# EAGLE schematic HWProgUSB (EAGLE 6.3)
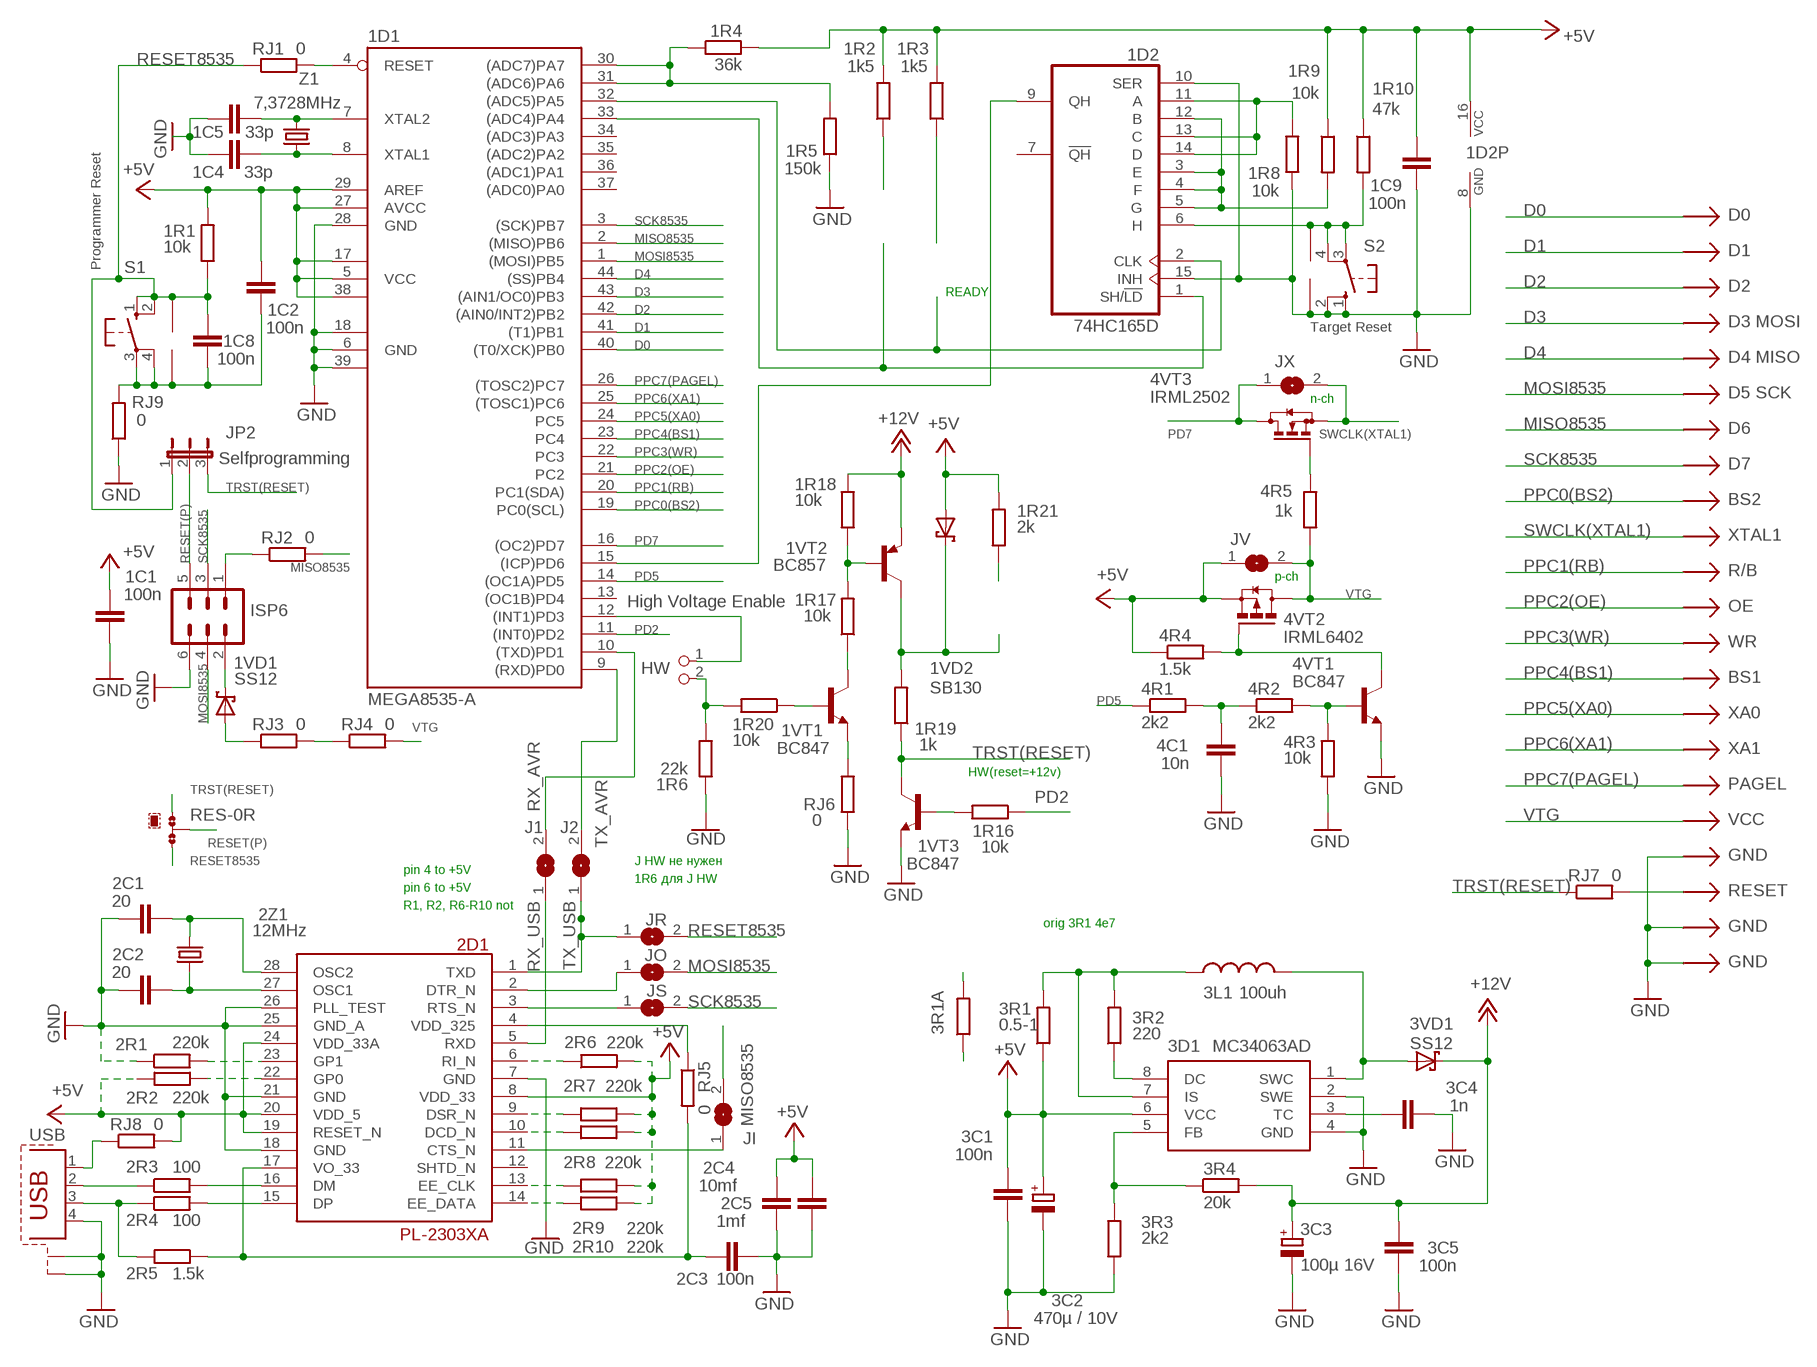
[diagram p0: schematic, sheet 1]

## Parts
1C1  100n  C-EUC0805  [C0805]
1C2  100n  C-EUC0805  [C0805]
1C4  33p  C-EUC0805  [C0805]
1C5  33p  C-EUC0805  [C0805]
1C8  100n  C-EUC0805  [C0805]
1C9  100n  C-EUC0805  [C0805]
1D1  MEGA8535-A  [TQFP44]
1D2  74HC165D  [SO16]
1R1  10k  R-EU_M0805  [M0805]
1R2  1k5  R-EU_M0805  [M0805]
1R3  1k5  R-EU_M0805  [M0805]
1R4  36k  R-EU_M0805  [M0805]
1R5  150k  R-EU_R1206  [R1206]
1R6  22k  R-EU_M1206  [M1206]
1R8  10k  R-EU_M0805  [M0805]
1R9  10k  R-EU_M0805  [M0805]
1R10  47k  R-EU_M0805  [M0805]
1R16  10k  R-EU_R0805  [R0805]
1R17  10k  R-EU_M0805  [M0805]
1R18  10k  R-EU_M0805  [M0805]
1R19  1k  R-EU_M0805  [M0805]
1R20  10k  R-EU_M0805  [M0805]
1R21  2k  R-EU_R1206W  [R1206W]
1VD1  SS12  SCHOTTKY-DIODESMD  [SMB]
1VD2  SB130  SCHOTTKY-DIODESMD  [SMB]
1VT1  BC847  [SOT23]
1VT2  BC857  BC857A-PNP-SOT23-BEC  [SOT23-BEC]
1VT3  BC847  [SOT23]
2C1  20  C-EUC0805  [C0805]
2C2  20  C-EUC0805  [C0805]
2C3  100n  C-EUC0805  [C0805]
2C4  10mf  C-EUC1210  [C1210]
2C5  1mf  C-EUC0805  [C0805]
2D1  PL-2303XA  [SSOP28DB]
2R1  220k  R-EU_R0603  [R0603]
2R2  220k  R-EU_R1206W  [R1206W]
2R3  100  R-EU_R0603  [R0603]
2R4  100  R-EU_R0603  [R0603]
2R5  1.5k  R-EU_R0603  [R0603]
2R6  220k  R-EU_R1206W  [R1206W]
2R7  220k  R-EU_R0603  [R0603]
2R8  220k  R-EU_R0603  [R0603]
2R9  220k  R-EU_R0603  [R0603]
2R10  220k  R-EU_R0603  [R0603]
2Z1  12MHz  CRYSTALHC49S  [HC49/S]
3C1  100n  C-EU025-024X044  [C025-024X044]
3C2  470µ / 10V  RCL_CPOL-EUE3.5-8  [RCL_E3,5-8]
3C3  100µ 16V  RCL_CPOL-EUE3.5-8  [RCL_E3,5-8]
3C4  1n  C-EU025-025X050  [C025-025X050]
3C5  100n  C-EU025-025X050  [C025-025X050]
3D1  MC34063AD  [SOIC8]
3L1  100uh  L-US0207/10  [0207/10]
3R1  0.5-1  R-EU_0204/7  [0204/7]
3R1A  R-EU_0204/7  [0204/7]
3R2  220  R-EU_0204/7  [0204/7]
3R3  2k2  R-EU_M0805  [M0805]
3R4  20k  R-EU_M0805  [M0805]
3VD1  SS12  SCHOTTKY-DIODESMD  [SMB]
4C1  10n  C-EUC1206  [C1206]
4R1  2k2  R-EU_M0805  [M0805]
4R2  2k2  R-EU_M1206  [M1206]
4R3  10k  R-EU_M0805  [M0805]
4R4  1.5k  R-EU_M0805  [M0805]
4R5  1k  R-EU_M0805  [M0805]
4VT1  BC847  [SOT23]
4VT2  IRML6402  FDN360P  [SUPER-SOT3]
4VT3  IRML2502  BSS123  [SOT23]
HW  High Voltage Enable  PINHEAD_PINHD-1X2  [PINHEAD_1X02]
ISP6  MA03-2  [MA03-2]
J1  SJ  [SJ]
J2  SJ  [SJ]
JI  SJ  [SJ]
JO  SJ  [SJ]
JP2  Selfprogramming  JUMPER_JP2E  [JUMPER_JP2]
JR  SJ  [SJ]
JS  SJ  [SJ]
JV  SJ  [SJ]
JX  SJ  [SJ]
RES  0R-JUMPA  [A0R-JMP]
RJ1  0  R-EU_R1206  [R1206]
RJ2  0  R-EU_R1206  [R1206]
RJ3  0  R-EU_R1206  [R1206]
RJ4  0  R-EU_R1206  [R1206]
RJ5  0  R-EU_R1206  [R1206]
RJ6  0  R-EU_R1206  [R1206]
RJ7  0  R-EU_R1206  [R1206]
RJ8  0  R-EU_R1206  [R1206]
RJ9  0  R-EU_R1206  [R1206]
S1  10-XX  [B3F-10XX]
S2  10-XX  [B3F-10XX]
U$1  5.08  [KEY]
U$2  5.08  [KEY]
USB  PROGRAMMER_PN61729-S  [PROGRAMMER_PN61729-S]
X2  P_AVR_P  [P_AVR]
Z1  7,3728MHz  CRYTALHC49U-V  [HC49U-V]

## Nets
3VUSB: 2C3.1 2D1.17(VO_33) 2R5.1 RJ5.2
+5V: 1C1.2 1C2.2 1C9.1 1D1.5(VCC) 1D1.17(VCC1) 1D1.27(AVCC) 1D1.29(AREF) 1D1.38(VCC2) 1D2.16(VCC) 1R1.2 1R2.2 1R3.2 1R4.2 1R9.1 1R10.1 1R21.2 1VD2.A 2C4.2 2C5.2 2D1.8(VDD_33) 2D1.19(RESET_N) 2D1.20(VDD_5) 2D1.24(VDD_33A) 2R2.1 2R6.2 2R7.1 2R8.1 2R9.1 2R10.1 3C1.1 3C2.+ 3D1.6(VCC) 3R1.1 3R1A.1 4R4.1 4VT2.2(S) JV.1 RJ8.2
+12V: 1R18.2 1VT2.E 3C3.+ 3C5.2 3R4.2 3VD1.C
D0: 1D1.40((T0/XCK)PB0) X2.D0
D1: 1D1.41((T1)PB1) X2.D1
D2: 1D1.42((AIN0/INT2)PB2) X2.D2
D3: 1D1.43((AIN1/OC0)PB3) X2.D3
D4: 1D1.44((SS)PB4) X2.D4
GND: 1C1.1 1C4.1 1C5.1 1C9.2 1D1.6(GND) 1D1.18(GND1) 1D1.28(GND) 1D1.39(GND2) 1D2.8(GND) 1D2.10(SER) 1D2.15(INH) 1R5.1 1R6.1 1R8.1 1VT3.2(E) 2C1.1 2C2.1 2C3.2 2C4.1 2C5.1 2D1.7(GND) 2D1.18(GND) 2D1.21(GND) 2D1.25(GND_A) 2D1.26(PLL_TEST) 2R1.1 3C1.2 3C2.- 3C3.- 3C4.2 3C5.1 3D1.2(SWE) 3D1.4(GND) 3R3.1 4C1.1 4R3.1 4VT1.2(E) ISP6.6 RJ6.1 RJ9.1 S2.1(S) S2.2(S1) U$2.P$1 USB.4 USB.S1 USB.S2 X2.GND X2.GND2 X2.P$1(LGND)
MISO8535: 1D1.2((MISO)PB6) JI.2 RJ2.2 X2.D6
MOSI8535: 1D1.1((MOSI)PB5) ISP6.4 JO.2 X2.D5
N4: 1D1.33((ADC4)PA4) 1D2.1(SH/!LD)
N$1: RJ7.2 X2.RESET
N$2: 1D1.4(RESET) RJ1.2
N$3: ISP6.1 RJ2.1
N$4: 2D1.4(VDD_325) RJ5.1
N$5: 1VT1.2(E) RJ6.2
N$6: 1VD1.C ISP6.2
N$7: 2D1.9(DSR_N) 2R7.2
N$9: 1VD1.A RJ3.1
N$10: RJ3.2 RJ4.1
N$12: 1C5.2 1D1.7(XTAL2) Z1.2
N$13: 1C4.2 1D1.8(XTAL1) Z1.1
N$14: RJ8.1 USB.1
N$15: 1C2.1 1C8.1 RJ9.2 S1.3(P) S1.4(P1) U$1.P$1
N$20: 1R21.1
N$21: 4R5.2 4VT3.1(G)
N$45: 2R4.1 2R5.2 USB.3
N$46: 2R3.1 USB.2
N$47: 2D1.15(DP) 2R4.2
N$48: 2D1.16(DM) 2R3.2
N$49: 2D1.23(GP1) 2R1.2
N$52: 2D1.22(GP0) 2R2.2
N$53: 2C1.2 2D1.28(OSC2) 2Z1.2
N$54: 2D1.11(CTS_N) JI.1
N$55: 4R2.2 4R3.2 4VT1.1(B)
N$56: 2C2.2 2D1.27(OSC1) 2Z1.1
N$58: 2D1.6(RI_N) 2R6.1
N$59: 4R4.2 4VT1.3(C) 4VT2.1(G)
N$60: 2D1.3(RTS_N) JS.1
N$62: 4C1.2 4R1.2 4R2.1
N$68: 2D1.13(EE_CLK) 2R9.2
N$69: 2D1.2(DTR_N) JO.1
N$70: 2D1.14(EE_DATA) 2R10.2
N$80: 2D1.10(DCD_N) 2R8.2
N$104: 3D1.8(DC) 3R2.1
N$105: 3D1.7(IS) 3L1.1 3R1.2 3R1A.2 3R2.2
N$106: 3D1.5(FB) 3R3.2 3R4.1
N$107: 3D1.1(SWC) 3L1.2 3VD1.A
N$108: 3C4.1 3D1.3(TC)
N$122: 1R3.1
N$123: 1D1.30((ADC7)PA7) 1D1.31((ADC6)PA6) 1R4.1 1R5.2
N$124: 1D1.32((ADC5)PA5) 1D2.2(CLK)
N$125: 1D2.6(H) 1R10.2 S2.3(P) S2.4(P1) U$2.P$2
N$131: 1D1.12((INT1)PD3) HW.1
N$132: 1R6.2 1R20.2 HW.2
N$133: 1R19.2 1VD2.C 1VT2.C
N$134: 1R20.1 1VT1.1(B)
N$135: 1R17.1 1VT1.3(C)
N$136: 1R17.2 1R18.1 1VT2.B
N$137: 1D1.15((ICP)PD6) 1D2.9(QH)
N$138: 1R2.1
N$139: 1D2.11(A) 1D2.13(C) 1D2.14(D) 1R8.2
N$140: 1D2.3(E) 1D2.4(F) 1D2.5(G) 1D2.12(B) 1R9.2
N$141: 1R16.2 1VT3.1(B)
PD2: 1D1.11((INT0)PD2) 1R16.1
PD5: 1D1.14((OC1A)PD5) 4R1.1
PD7: 1D1.16((OC2)PD7) 4VT3.3(D) JX.1
PPC0(BS2): 1D1.19(PC0(SCL)) X2.BS2
PPC1(RB): 1D1.20(PC1(SDA)) X2.RB
PPC2(OE): 1D1.21(PC2) X2.OE
PPC3(WR): 1D1.22(PC3) X2.WR
PPC4(BS1): 1D1.23(PC4) X2.BS1
PPC5(XA0): 1D1.24(PC5) X2.XA0
PPC6(XA1): 1D1.25((TOSC1)PC6) X2.XA1
PPC7(PAGEL): 1D1.26((TOSC2)PC7) X2.PAGEL
RESET8535: 1C8.2 1R1.1 JP2.1 JR.2 RES.3 RJ1.1 S1.1(S) S1.2(S1) U$1.P$2
RESET(P): ISP6.5 JP2.2 RES.2
RX_AVR: 1D1.10((TXD)PD1) J1.2
RX_USB: 2D1.5(RXD) J1.1
SCK8535: 1D1.3((SCK)PB7) ISP6.3 JS.2 X2.D7
SWCLK(XTAL1): 4VT3.2(S) JX.2 X2.XTAL1
TRST(RESET): 1R19.1 1VT3.3(C) JP2.3 RES.1 RJ7.1
TX_AVR: 1D1.9((RXD)PD0) J2.2
TX_USB: 2D1.1(TXD) J2.1 JR.1
VTG: 4R5.1 4VT2.3(D) JV.2 RJ4.2 X2.VCC
Unconnected: 1D1.13((OC1B)PD4) 1D1.34((ADC3)PA3) 1D1.35((ADC2)PA2) 1D1.36((ADC1)PA1) 1D1.37((ADC0)PA0) 1D2.7(!QH) 2D1.12(SHTD_N)

## Notes on the sheet
- Programmer Reset
- READY
- Target Reset
- n-ch
- p-ch
- HW(reset=+12v)
- J HW не нужен
- pin 4 to +5V
- 1R6 для J HW
- pin 6 to +5V
- R1, R2, R6-R10 not
- orig 3R1 4e7

## Library data of the parts
1C1 1C2 1C4 1C5 1C8 1C9 2C4 2C5 3C4 3C5 4C1 = rcl:C-EU: CAPACITOR, European symbol
1D1 = atmel:MEGA8535: MICROCONTROLLER 8 Kbytes FLASH 512 bytes SRAM 512 bytes EEPROM USART 8-channel 10 bit ADC Source: avr.lbr; MPN: ATMEGA8535-16AU; OC_FARNELL: 1528437; OC_NEWARK: 01M6908
1D2 = 74xx-eu:74*165: 8-bit parallel load SHIFT REGISTER
1R1-1R6 1R8-1R10 1R16-1R21 3R1 3R1A 3R2-3R4 4R1-4R5 RJ1-RJ9 = rcl:R-EU_: RESISTOR, European symbol
1VD1 1VD2 3VD1 = diode:SCHOTTKY-DIODE: Schottky Diode
1VT1 1VT3 = transistor:BC847: NPN TRANSISTOR
1VT2 = transistor:*-PNP-: PNP Transistror
2C1-2C3 = resistor:C-EU: CAPACITOR, European symbol
2D1 = SparkFun-DigitalIC:PL-2303XA: Prolific USB chip, requires 12MHz xtal
2R1-2R10 = resistor:R-EU_: RESISTOR, European symbol
2Z1 = crystal:CRYSTAL: CRYSTAL; OC_FARNELL: 1667008; OC_NEWARK: unknown
3C1 = rc-elektronik:C-EU: CAPACITOR, European symbol
3C2 3C3 = HWProgUSB:RCL_CPOL-EU: POLARIZED CAPACITOR, European symbol
3D1 = mc34063:MC34063
3L1 = rcl:L-US: INDUCTOR, American symbol
4VT1 = transistor-neu-to92:BC847: NPN TRANSISTOR
4VT2 = transistor-power:FDN360P: Single P-Channel, PowerTrench (R) MOSFET Source: http://www.fairchildsemi.com/ds/FD/FDN360P.pdf
4VT3 = transistor-small-signal:BSS123: N-CHANNEL MOS FET
HW = HWProgUSB:PINHEAD_PINHD-1X2: PIN HEADER
ISP6 = con-lstb:MA03-2: PIN HEADER
J1 J2 JI JO JR JS JV JX = jumper:SJ: SMD solder JUMPER
JP2 = HWProgUSB:JUMPER_JP2E: JUMPER
RES = jump-0r-smd:0R-JUMP: SMD 0R 0805 Jumper
S1 S2 = switch-omron:10-XX: OMRON SWITCH
U$1 U$2 = Programmer:5.08
USB = HWProgUSB:PROGRAMMER_PN61729-S: BERG USB connector
X2 = Programmer:P_AVR
Z1 = crystal:CRYTAL: CRYSTAL